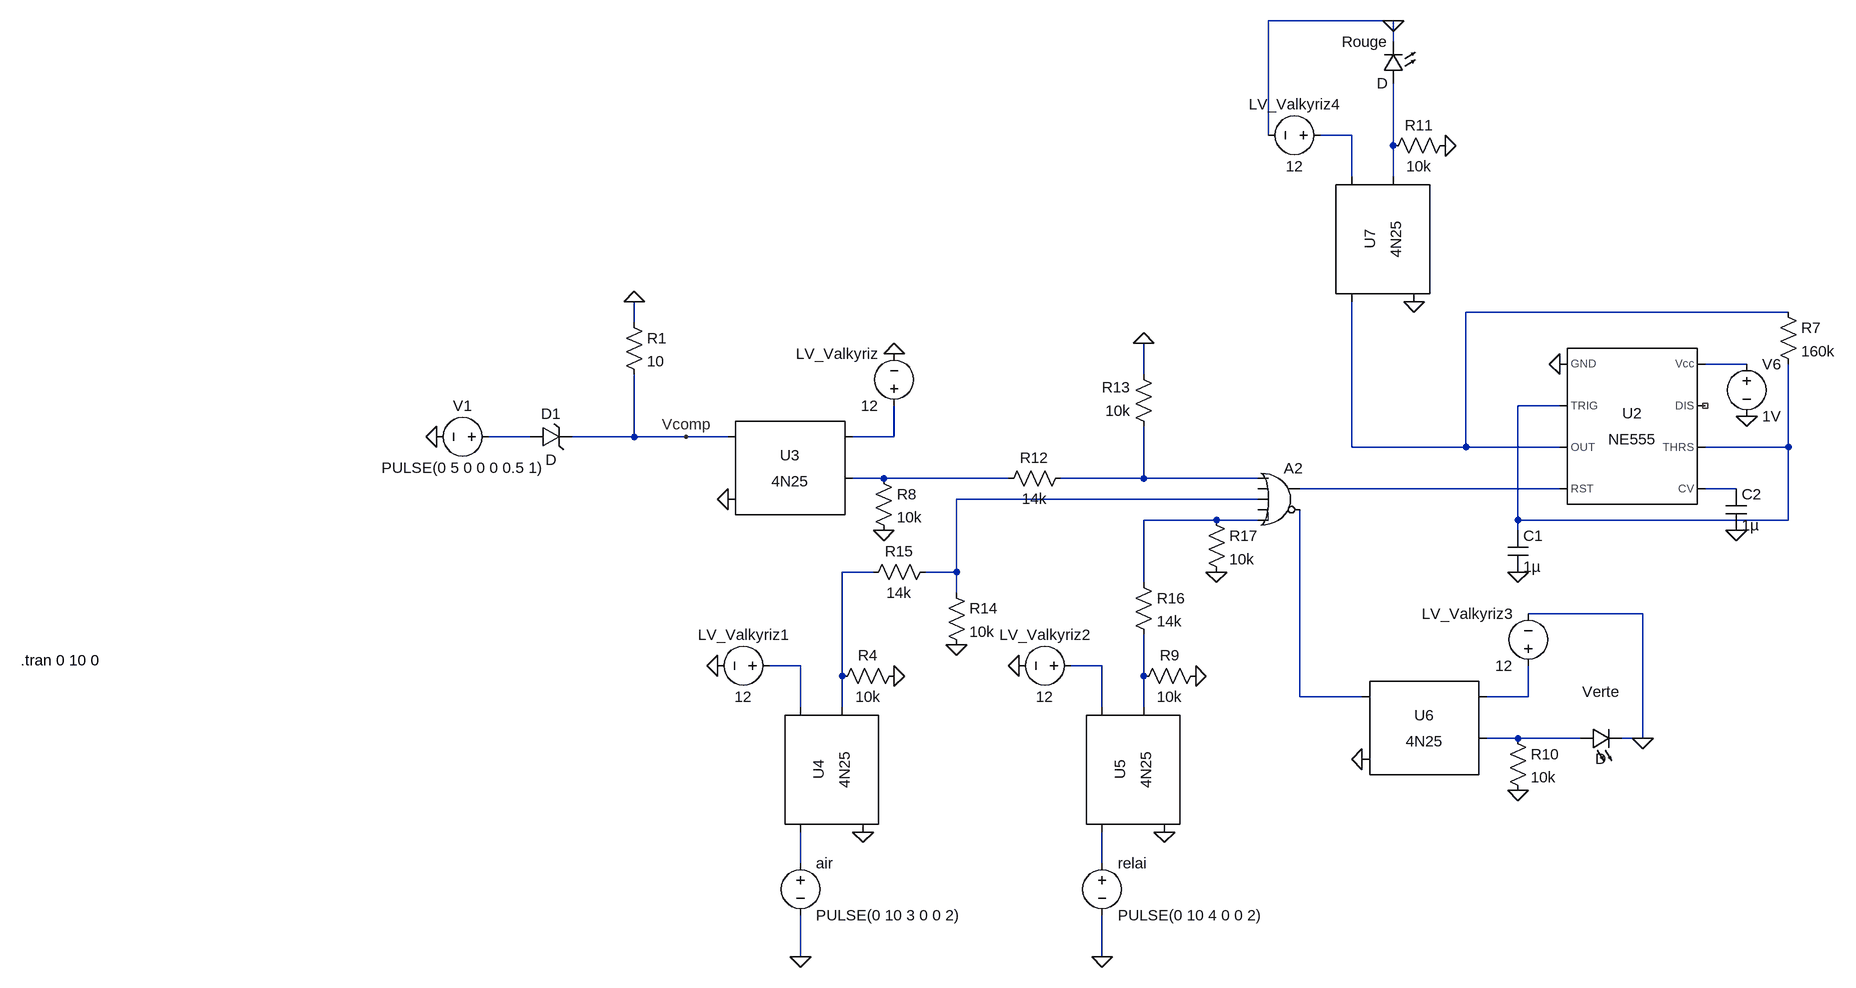
[diagram p0: schematic détectionv2.asc]
détectionv2.asc, the LTspice schematic file:
Version 4
SHEET 1 2864 916
WIRE 2032 -656 1840 -656
WIRE 2032 -624 2032 -656
WIRE 1840 -480 1840 -656
WIRE 1968 -480 1920 -480
WIRE 2032 -464 2032 -560
WIRE 1968 -416 1968 -480
WIRE 2032 -416 2032 -464
WIRE 2640 -208 2144 -208
WIRE 864 -192 864 -224
WIRE 2576 -128 2512 -128
WIRE 1648 -112 1648 -160
WIRE 2288 -64 2224 -64
WIRE 704 -16 640 -16
WIRE 864 -16 864 -112
WIRE 864 -16 768 -16
WIRE 944 -16 864 -16
WIRE 1008 -16 944 -16
WIRE 1264 -16 1264 -64
WIRE 1264 -16 1200 -16
WIRE 1968 0 1968 -224
WIRE 2144 0 2144 -208
WIRE 2144 0 1968 0
WIRE 2288 0 2144 0
WIRE 2640 0 2640 -128
WIRE 2640 0 2512 0
WIRE 1248 48 1200 48
WIRE 1440 48 1248 48
WIRE 1648 48 1648 -32
WIRE 1648 48 1520 48
WIRE 1824 48 1648 48
WIRE 2288 64 1888 64
WIRE 2560 64 2512 64
WIRE 1824 80 1360 80
WIRE 1760 112 1648 112
WIRE 1824 112 1760 112
WIRE 2224 112 2224 -64
WIRE 2640 112 2640 0
WIRE 2640 112 2224 112
WIRE 2224 128 2224 112
WIRE 1232 192 1184 192
WIRE 1360 192 1360 80
WIRE 1360 192 1312 192
WIRE 1648 208 1648 112
WIRE 1360 224 1360 192
WIRE 2416 256 2240 256
WIRE 1120 336 1072 336
WIRE 1584 336 1536 336
WIRE 1184 352 1184 192
WIRE 1648 352 1648 288
WIRE 1888 384 1888 96
WIRE 1984 384 1888 384
WIRE 2240 384 2240 336
WIRE 2240 384 2176 384
WIRE 1120 400 1120 336
WIRE 1184 400 1184 352
WIRE 1584 400 1584 336
WIRE 1648 400 1648 352
WIRE 2224 448 2176 448
WIRE 2320 448 2224 448
WIRE 2416 448 2416 256
WIRE 2416 448 2384 448
WIRE 1120 640 1120 592
WIRE 1584 640 1584 592
WIRE 1120 784 1120 720
WIRE 1584 784 1584 720
FLAG 1120 784 0
FLAG 1584 784 0
FLAG 2288 -128 0
FLAG 2560 128 0
FLAG 2224 192 0
FLAG 2576 -48 0
FLAG 1008 80 0
FLAG 1264 -144 0
FLAG 1248 128 0
FLAG 944 -16 Vcomp
FLAG 1216 592 0
FLAG 992 336 0
FLAG 1264 352 0
FLAG 1680 592 0
FLAG 1456 336 0
FLAG 1728 352 0
FLAG 1984 480 0
FLAG 2224 528 0
FLAG 2416 448 0
FLAG 2064 -224 0
FLAG 2112 -464 0
FLAG 2032 -656 0
FLAG 1648 -160 0
FLAG 1360 304 0
FLAG 1760 192 0
FLAG 560 -16 0
FLAG 864 -224 0
SYMBOL voltage 1120 624 R0
WINDOW 123 0 0 Left 0
WINDOW 39 0 0 Left 0
SYMATTR InstName air
SYMATTR Value PULSE(0 10 3 0 0 2)
SYMBOL voltage 1584 624 R0
WINDOW 123 0 0 Left 0
WINDOW 39 0 0 Left 0
SYMATTR InstName relai
SYMATTR Value PULSE(0 10 4 0 0 2)
SYMBOL Misc\\NE555 2400 -32 R0
SYMATTR InstName U2
SYMBOL cap 2208 128 R0
SYMATTR InstName C1
SYMATTR Value 1µ
SYMBOL cap 2544 64 R0
SYMATTR InstName C2
SYMATTR Value 1µ
SYMBOL res 2624 -224 R0
SYMATTR InstName R7
SYMATTR Value 160k
SYMBOL voltage 2576 -144 R0
SYMATTR InstName V6
SYMATTR Value 1V
SYMBOL Digital\\or 1856 16 R0
SYMATTR InstName A2
SYMBOL LED 2320 464 R270
WINDOW 0 72 32 VTop 2
WINDOW 3 0 32 VBottom 2
SYMATTR InstName Verte
SYMBOL Optos\\4N25 1104 48 R0
SYMATTR InstName U3
SYMBOL voltage 1264 -48 R180
WINDOW 0 24 96 Left 2
WINDOW 3 24 16 Left 2
SYMATTR InstName LV_Valkyriz
SYMATTR Value 12
SYMBOL res 1232 32 R0
SYMATTR InstName R8
SYMATTR Value 10k
SYMBOL Optos\\4N25 1184 496 R270
SYMATTR InstName U4
SYMBOL voltage 1088 336 R90
WINDOW 0 -32 56 VBottom 2
WINDOW 3 32 56 VTop 2
SYMATTR InstName LV_Valkyriz1
SYMATTR Value 12
SYMBOL res 1168 368 R270
WINDOW 0 32 56 VTop 2
WINDOW 3 0 56 VBottom 2
SYMATTR InstName R4
SYMATTR Value 10k
SYMBOL Optos\\4N25 1648 496 R270
SYMATTR InstName U5
SYMBOL voltage 1552 336 R90
WINDOW 0 -32 56 VBottom 2
WINDOW 3 32 56 VTop 2
SYMATTR InstName LV_Valkyriz2
SYMATTR Value 12
SYMBOL res 1632 368 R270
WINDOW 0 32 56 VTop 2
WINDOW 3 0 56 VBottom 2
SYMATTR InstName R9
SYMATTR Value 10k
SYMBOL Optos\\4N25 2080 448 R0
SYMATTR InstName U6
SYMBOL voltage 2240 352 R180
WINDOW 0 24 96 Left 2
WINDOW 3 24 16 Left 2
SYMATTR InstName LV_Valkyriz3
SYMATTR Value 12
SYMBOL res 2208 432 R0
SYMATTR InstName R10
SYMATTR Value 10k
SYMBOL LED 2048 -560 R180
WINDOW 0 24 64 Left 2
WINDOW 3 24 0 Left 2
SYMATTR InstName Rouge
SYMBOL Optos\\4N25 2032 -320 R270
SYMATTR InstName U7
SYMBOL voltage 1936 -480 R90
WINDOW 0 -32 56 VBottom 2
WINDOW 3 32 56 VTop 2
SYMATTR InstName LV_Valkyriz4
SYMATTR Value 12
SYMBOL res 2016 -448 R270
WINDOW 0 32 56 VTop 2
WINDOW 3 0 56 VBottom 2
SYMATTR InstName R11
SYMATTR Value 10k
SYMBOL res 1536 32 R90
WINDOW 0 0 56 VBottom 2
WINDOW 3 32 56 VTop 2
SYMATTR InstName R12
SYMATTR Value 14k
SYMBOL res 1664 -16 R180
WINDOW 0 36 76 Left 2
WINDOW 3 36 40 Left 2
SYMATTR InstName R13
SYMATTR Value 10k
SYMBOL res 1344 208 R0
SYMATTR InstName R14
SYMATTR Value 10k
SYMBOL res 1328 176 R90
WINDOW 0 0 56 VBottom 2
WINDOW 3 32 56 VTop 2
SYMATTR InstName R15
SYMATTR Value 14k
SYMBOL res 1632 192 R0
SYMATTR InstName R16
SYMATTR Value 14k
SYMBOL res 1744 96 R0
SYMATTR InstName R17
SYMATTR Value 10k
SYMBOL voltage 656 -16 R90
WINDOW 0 -32 56 VBottom 2
WINDOW 3 32 56 VTop 2
WINDOW 123 0 0 Left 0
WINDOW 39 0 0 Left 0
SYMATTR InstName V1
SYMATTR Value PULSE(0 5 0 0 0 0.5 1)
SYMBOL zener 704 0 R270
WINDOW 0 36 32 VTop 2
WINDOW 3 -4 32 VBottom 2
SYMATTR InstName D1
SYMBOL res 848 -208 R0
SYMATTR InstName R1
SYMATTR Value 10
TEXT -80 328 Left 2 !.tran 0 10 0

The netlist it stands for:
* détectionv2.asc
V§air N021 0 PULSE(0 10 3 0 0 2)
V§relai N022 0 PULSE(0 10 4 0 0 2)
XU2 0 N005 N003 N010 N011 N005 NC_01 N004 NE555  ; pins GND TRIG OUT RST CV THRS DIS Vcc
C1 N005 0 1µ
C2 N011 0 1µ
R7 N003 N005 160k
V6 N004 0 1V
A2 N009 0 N012 0 N013 N018 N010 0 OR
D§Verte N020 0 D
XU3 Vcomp 0 N007 N008 NC_02 4N25
V§LV_Valkyriz N007 0 12
R8 N008 0 10k
XU4 N021 0 N015 N014 NC_03 4N25
V§LV_Valkyriz1 N015 0 12
R4 N014 0 10k
XU5 N022 0 N016 N017 NC_04 4N25
V§LV_Valkyriz2 N016 0 12
R9 N017 0 10k
XU6 N018 0 N019 N020 NC_05 4N25
V§LV_Valkyriz3 N019 0 12
R10 N020 0 10k
D§Rouge N002 0 D
XU7 N003 0 N001 N002 NC_06 4N25
V§LV_Valkyriz4 N001 0 12
R11 N002 0 10k
R12 N009 N008 14k
R13 N009 0 10k
R14 N012 0 10k
R15 N012 N014 14k
R16 N013 N017 14k
R17 N013 0 10k
V1 N006 0 PULSE(0 5 0 0 0 0.5 1)
D1 N006 Vcomp D
R1 0 Vcomp 10
.model D D
.lib standard.dio
.tran 0 10 0
.lib NE555.sub
.lib 4N25.sub
.backanno
.end